# Altium schematic sheet HeatMapNodeV1.SchDoc: HeatMap Node
size Letter; Date: 1/5/2017 3:00:38 PM; Author: Team HeatMap; DocumentNumber: 01; Revision: 01; SheetNumber: 1; SheetTotal: 1; REV: 1
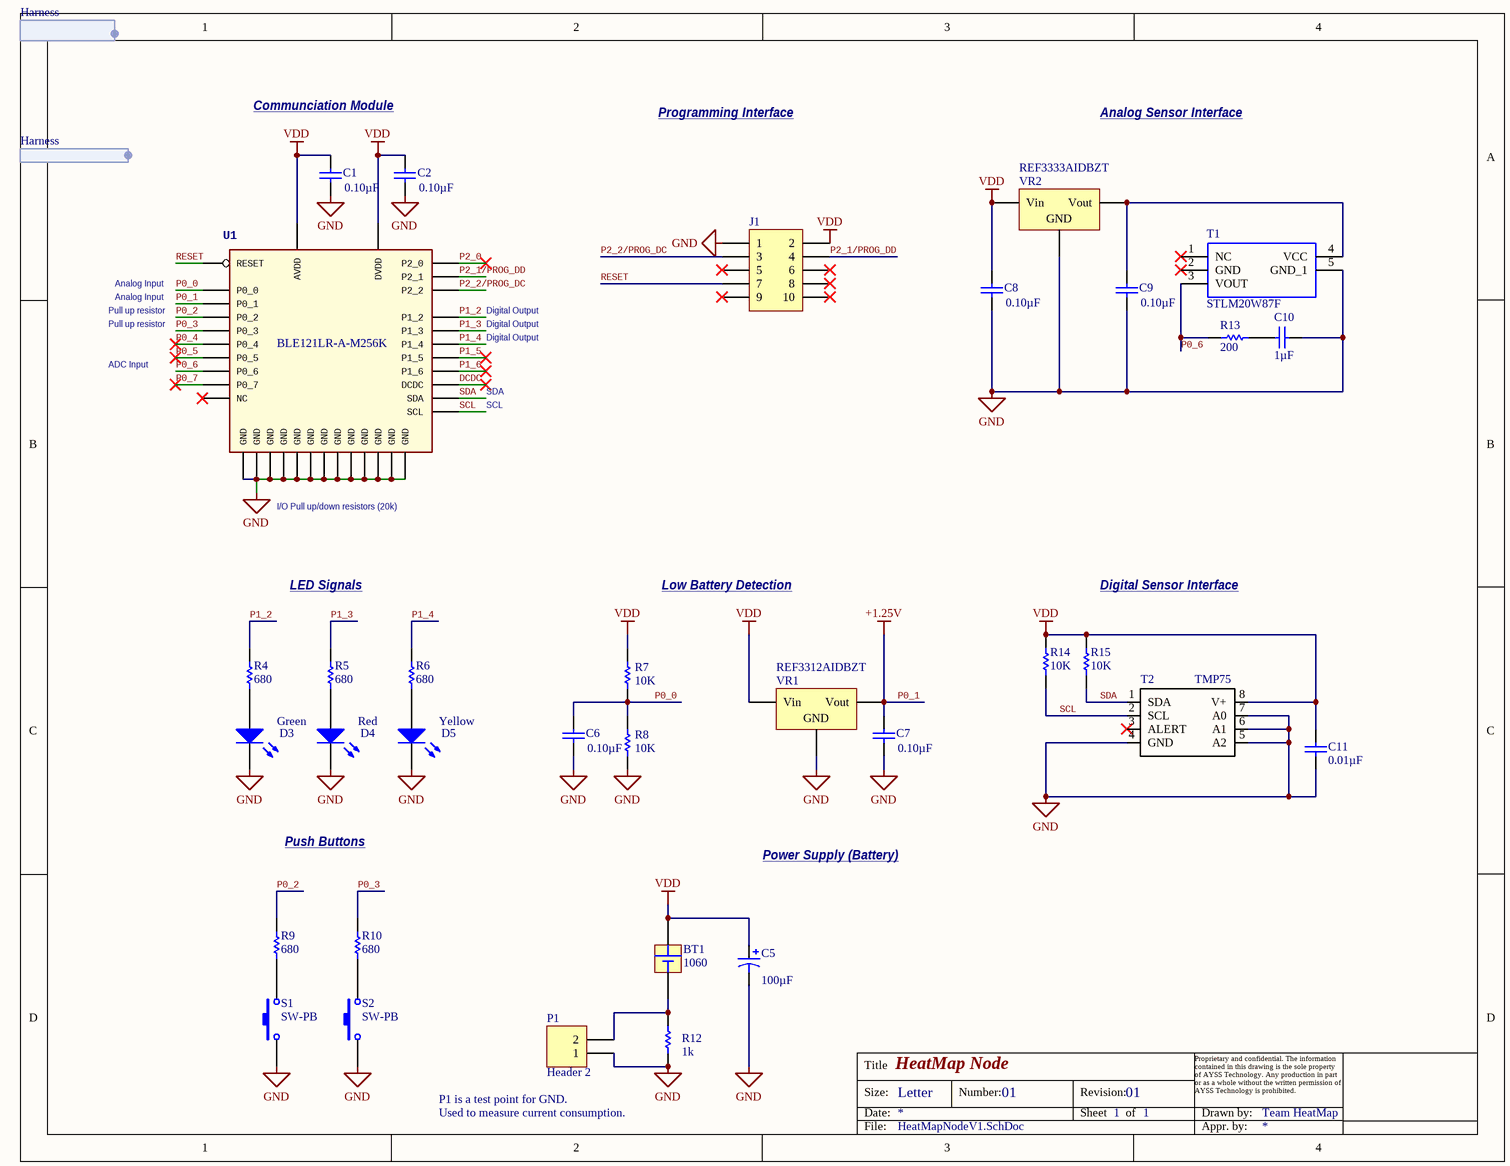
[diagram p0: HeatMapNodeV1.SchDoc]

## Parts
BT1  1060  [1060]
C1  value 0.10µF  [6-0805_M]  (hidden comment: Cap Semi)
C2  value 0.10µF  [6-0805_M]  (hidden comment: Cap Semi)
C5  value 100µF  [D]  (hidden comment: Cap Pol3)
C6  value 0.10µF  [6-0805_M]  (hidden comment: Cap Semi)
C7  value 0.10µF  [6-0805_M]  (hidden comment: Cap Semi)
C8  value 0.10µF  [6-0805_M]  (hidden comment: Cap Semi)
C9  value 0.10µF  [6-0805_M]  (hidden comment: Cap Semi)
C10  value 1µF  [6-0805_M]  (hidden comment: Cap Semi)
C11  value 0.01µF  [6-0805_M]  (hidden comment: Cap Semi)
D3  Color: Green  [2.0X1.25X1.2]  (hidden comment: LED2)
D4  Color: Red  [2.0X1.25X1.2]  (hidden comment: LED2)
D5  Color: Yellow  [2.0X1.25X1.2]  (hidden comment: LED2)
J1  Header 5X2  [HDR2X5_SMD_127]  (value not drawn)
P1  Header 2  [HDR1X2]
R4  value 680  [6-0805_M]  (hidden comment: Res1)
R5  value 680  [6-0805_M]  (hidden comment: Res1)
R6  value 680  [6-0805_M]  (hidden comment: Res1)
R7  value 10K  [6-0805_M]  (hidden comment: Res1)
R8  value 10K  [6-0805_M]  (hidden comment: Res1)
R9  value 680  [6-0805_M]  (hidden comment: Res1)
R10  value 680  [6-0805_M]  (hidden comment: Res1)
R12  value 1k  [6-0805_M]  (hidden comment: Res1)
R13  value 200  [6-0805_M]  (hidden comment: Res1)
R14  value 10K  [6-0805_M]  (hidden comment: Res1)
R15  value 10K  [6-0805_M]  (hidden comment: Res1)
S1  SW-PB  [SA]
S2  SW-PB  [SA]
T1  STLM20W87F  [SOT65P210X110-5N]
T2  TMP75  [MSOP8]
U1  Manufacturer Part Number: BLE121LR-A-M256K  [BLE121LR]  (hidden comment: BLE121LR module)
VR1  Manufacturer Part Number: REF3312AIDBZT  [SOT23_M]  (hidden comment: Volt Reg)
VR2  Manufacturer Part Number: REF3333AIDBZT  [SOT23_M]  (hidden comment: Volt Reg)

## Harnesses
Harness: 

## Nets
GND: C1.1 C2.1 C5.2 C6.1 C7.1 C8.1 C9.1 C10.1 C11.1 D3.2(K) D4.2(K) D5.2(K) J1.1 P1.1 R8.1 R12.2 S1.1 S2.1 T1.5(GND_1) T2.4(GND) T2.5(A2) T2.6(A1) T2.7(A0) U1.1(GND) U1.2(GND) U1.3(GND) U1.14(GND) U1.15(GND) U1.16(GND) U1.22(GND) U1.31(GND) U1.32(GND) U1.33(GND) U1.34(GND) U1.35(GND) U1.36(GND) VR1.2(GND) VR2.2(GND)
P0_1: C7.2 U1.5(P0_1) VR1.3(Vout)  [also labelled +1.25V]
VDD: BT1.2(+) C1.2 C2.2 C5.1 C8.2 C11.2 J1.2 R7.2 R14.1 R15.1 T2.8(V+) U1.13(AVDD) U1.23(DVDD) VR1.1(Vin) VR2.1(Vin)
DCDC: U1.18(DCDC)
P0_0: C6.2 R7.1 R8.2 U1.6(P0_0)
P0_2: R9.1 U1.4(P0_2)
P0_3: R10.1 U1.8(P0_3)
P0_4: U1.9(P0_4)
P0_5: U1.10(P0_5)
P0_6: R13.1 T1.3(VOUT) U1.11(P0_6)
P0_7: U1.12(P0_7)
P1_2: R4.1 U1.30(P1_2)
P1_3: R5.1 U1.29(P1_3)
P1_4: R6.1 U1.28(P1_4)
P1_5: U1.27(P1_5)
P1_6: U1.17(P1_6)
P2_0: U1.19(P2_0)
P2_1/PROG_DD: J1.4 U1.20(P2_1)
P2_2/PROG_DC: J1.3 U1.21(P2_2)
RESET: J1.7 U1.7(RESET)
SCL: R14.2 T2.2(SCL) U1.24(SCL)
SDA: R15.2 T2.1(SDA) U1.25(SDA)
NetBT1_1: BT1.1(-) P1.2 R12.1
NetC9_2: C9.2 T1.4(VCC) VR2.3(Vout)
NetC10_2: C10.2 R13.2
NetD3_1: D3.1(A) R4.2
NetD4_1: D4.1(A) R5.2
NetD5_1: D5.1(A) R6.2
NetR9_2: R9.2 S1.2
NetR10_2: R10.2 S2.2

Not connected (* = marked no-connect by the designer): J1 5* 6* 8* 9* 10*; T1 1(NC)* 2(GND)*; T2 3(ALERT)*; U1 26(NC)*

## Notes on the sheet
- Communciation Module
- Programming Interface
- Analog Sensor Interface
- Analog Input
- (near U1) Pull up resistor
- ADC Input
- Digital Output
- SDA
- SCL
- (near U1) I/O Pull up/down resistors (20k)
- LED Signals
- Low Battery Detection
- Digital Sensor Interface
- Push Buttons
- Power Supply (Battery)
- (near P1) P1 is a test point for GND.
- Used to measure current consumption.
- Title
- Size:
- Date:
- Letter
- Number:
- Revision:
- Sheet
- of
- Proprietary and confidential. The information contained in this drawing is the sole property of AYSS Technology. Any production in part or as a whole without the written permission of AYSS Technology is prohibited.
- Drawn by:
- File:
- Appr. by:

## Library data of the parts
BT1 = Battery: Coin Cell Battery 2032 Holder; Manufacturer: Keystone Electronics; Battery Type, Function: Coin Cell, Holder; Style: Holder (Open); Battery Cell Size: Coin, 20.0mm; Number of Cells: 1; Battery Series: 2032; Supplier 1: Digi-Key; Supplier Part Number 1: 36-1060-ND; Manufacturer Part Number: 1060; RoHS: RoHS Compliant; Category: Battery Products; Stock 1: 5034; Pricing 1: 1=1.79, 10=1.475, 50=1.3244, 100=1.2642, 250=1.1438, 500=1.0535, 1000=1.01202, 2500=0.903, 5000=0.80066 (USD); Part Status: Active; Mounting Type: PCB, Surface Mount; Termination Style: SMD (SMT) Tab; Height Above Board: 0.217" (5.50mm); Operating Temperature: -50°C ~ 145°C; ComponentLink1URL: http://www.keyelco.com/product-pdf.cfm?p=726; ComponentLink1Description: http://www.keyelco.com/product-pdf.cfm?p=726
C1 C2 C6-C9 = Cap Semi: Capacitor (Semiconductor SIM Model); Manufacturer: Taiyo Yuden; Manufacturer Part Number: HMK212B7104KG-T; Tolerance: ±10%; Voltage - Rated: 100V; Temperature Coefficient: X7R; Published: 8-Jun-2000; LatestRevisionDate: 29-May-2009; LatestRevisionNote: IPC-7351 Footprint Added.; Publisher: Altium Limited; PackageDescription: Chip Capacitor; Supplier 1: Digi-Key; Supplier Part Number 1: 587-1276-1-ND; RoHS: RoHS Compliant; Category: Capacitors; Stock 1: 4553; Pricing 1: 1=0.19, 10=0.128, 25=0.0936, 50=0.0766, 100=0.0647, 250=0.05276, 500=0.04426, 1000=0.03915 (USD); Packaging: Cut Tape (CT); Part Status: Active; Capacitance: 0.10µF; Operating Temperature: -55°C ~ 125°C; Features: High Voltage; Ratings: -; Applications: General Purpose; Mounting Type: Surface Mount, MLCC; Package / Case: 0805 (2012 Metric); Size / Dimension: 0.079" L x 0.049" W (2.00mm x 1.25mm); Height - Seated (Max): -; Thickness (Max): 0.053" (1.35mm); Lead Spacing: -; Lead Style: -; ComponentLink1URL: http://ds.yuden.co.jp/TYCOMPAS/ut/detail.do?productNo=HMK212B7104KG-T&fileName=HMK212B7104KG-T_SS&mode=specSheetDownload; ComponentLink1Description: http://ds.yuden.co.jp/TYCOMPAS/ut/detail.do?productNo=HMK212B7104KG-T&fileName=HMK212B7104KG-T_SS&mode=specSheetDownload
C5 = Cap Pol3: Polarized Capacitor (Surface Mount); Manufacturer: KEMET; Manufacturer Part Number: T495D107K016ATE125; Tolerance: ±10%; Voltage - Rated: 16V; Type: Molded; ESR (Equivalent Series Resistance): 125 mOhm; Lifetime @ Temp.: 2000 Hrs @ 85°C; Published: 8-Jun-2000; LatestRevisionDate: 29-May-2009; LatestRevisionNote: IPC-7351 Footprint Added.; PackageReference: C0805; Publisher: Altium Limited; PackageDescription: Chip Capacitor; Supplier 1: Digi-Key; Supplier Part Number 1: 399-8499-1-ND; RoHS: RoHS Compliant; Category: Capacitors; Stock 1: 19470; Pricing 1: 1=1.37, 10=1.084, 25=0.9936, 50=0.9394, 100=0.8129, 250=0.72264 (USD); Packaging: Cut Tape (CT); Part Status: Active; Capacitance: 100µF; Operating Temperature: -55°C ~ 125°C; Mounting Type: Surface Mount; Package / Case: 2917 (7343 Metric); Size / Dimension: 0.287" L x 0.169" W (7.30mm x 4.30mm); Height - Seated (Max): 0.122" (3.10mm); Lead Spacing: -; Manufacturer Size Code: D; Features: General Purpose; Failure Rate: -; ComponentLink1URL: http://www.kemet.com/docfinder?Partnumber=T495D107K016ATE125; ComponentLink1Description: http://www.kemet.com/docfinder?Partnumber=T495D107K016ATE125
C10 C11 = Cap Semi: Capacitor (Semiconductor SIM Model); Manufacturer: Taiyo Yuden; Manufacturer Part Number: HMK212B7104KG-T; Capacitance: 0.10µF; Tolerance: ±10%; Voltage - Rated: 100V; Temperature Coefficient: X7R; Published: 8-Jun-2000; LatestRevisionDate: 29-May-2009; LatestRevisionNote: IPC-7351 Footprint Added.; Publisher: Altium Limited; PackageDescription: Chip Capacitor; Supplier 1: Digi-Key; Supplier Part Number 1: 587-1276-1-ND; RoHS: RoHS Compliant; Category: Capacitors; Stock 1: 4553; Pricing 1: 1=0.19, 10=0.128, 25=0.0936, 50=0.0766, 100=0.0647, 250=0.05276, 500=0.04426, 1000=0.03915 (USD); Packaging: Cut Tape (CT); Part Status: Active; Operating Temperature: -55°C ~ 125°C; Features: High Voltage; Ratings: -; Applications: General Purpose; Mounting Type: Surface Mount, MLCC; Package / Case: 0805 (2012 Metric); Size / Dimension: 0.079" L x 0.049" W (2.00mm x 1.25mm); Height - Seated (Max): -; Thickness (Max): 0.053" (1.35mm); Lead Spacing: -; Lead Style: -; ComponentLink1URL: http://ds.yuden.co.jp/TYCOMPAS/ut/detail.do?productNo=HMK212B7104KG-T&fileName=HMK212B7104KG-T_SS&mode=specSheetDownload; ComponentLink1Description: http://ds.yuden.co.jp/TYCOMPAS/ut/detail.do?productNo=HMK212B7104KG-T&fileName=HMK212B7104KG-T_SS&mode=specSheetDownload
D3 = LED2: Typical RED, GREEN, YELLOW, AMBER GaAs LED; Manufacturer: Visual Communications Company - VCC; Manufacturer Part Number: CMD17-21VGD/TR8; Lens Transparency: Diffused; Millicandela Rating: 7mcd; Lens Style/Size: Rectangle with Flat Top, 1.40mm x 1.25mm; Voltage - Forward (Vf) (Typ): 2.1V; Current - Test: 20mA; Viewing Angle: 140°; Wavelength - Peak: 570nm; Supplier 1: Digi-Key; Supplier Part Number 1: L62505CT-ND; RoHS: RoHS Compliant; Category: Optoelectronics; Stock 1: 21325; Pricing 1: 1=0.5, 10=0.364, 25=0.2972, 100=0.2376, 250=0.20048, 500=0.17078, 1000=0.13365 (USD); Packaging: Cut Tape (CT); Part Status: Active; Lens Color: Green; Mounting Type: Surface Mount; Wavelength - Dominant: -; Features: -; Package / Case: 0805 (2012 Metric); Supplier Device Package: 0805; Size / Dimension: 2.00mm L x 1.25mm W; Height (Max): 1.20mm; ComponentLink1URL: http://vcclite.com/_pdf/CMD17-21%20Series%20SMT%20LEDs%200805%20Package%20Size.pdf; ComponentLink1Description: http://vcclite.com/_pdf/CMD17-21%20Series%20SMT%20LEDs%200805%20Package%20Size.pdf
D4 = LED2: Typical RED, GREEN, YELLOW, AMBER GaAs LED; Manufacturer: Visual Communications Company - VCC; Manufacturer Part Number: CMD17-21VRD/TR8; Lens Transparency: Diffused; Millicandela Rating: 6mcd; Lens Style/Size: Rectangle with Flat Top, 1.40mm x 1.25mm; Voltage - Forward (Vf) (Typ): 2V; Current - Test: 20mA; Viewing Angle: 140°; Wavelength - Peak: 640nm; Supplier 1: Digi-Key; Supplier Part Number 1: L62501CT-ND; RoHS: RoHS Compliant; Category: Optoelectronics; Stock 1: 24797; Pricing 1: 1=0.54, 10=0.388, 25=0.3168, 100=0.2534, 250=0.21384, 500=0.18216, 1000=0.14256 (USD); Packaging: Cut Tape (CT); Part Status: Active; Lens Color: Red; Mounting Type: Surface Mount; Wavelength - Dominant: -; Features: -; Package / Case: 0805 (2012 Metric); Supplier Device Package: 0805; Size / Dimension: 2.00mm L x 1.25mm W; Height (Max): 1.20mm; ComponentLink1URL: http://vcclite.com/_pdf/CMD17-21%20Series%20SMT%20LEDs%200805%20Package%20Size.pdf; ComponentLink1Description: http://vcclite.com/_pdf/CMD17-21%20Series%20SMT%20LEDs%200805%20Package%20Size.pdf
D5 = LED2: Typical RED, GREEN, YELLOW, AMBER GaAs LED; Manufacturer: Visual Communications Company - VCC; Manufacturer Part Number: CMD17-21VYD/TR8; Lens Transparency: Diffused; Millicandela Rating: 4mcd; Lens Style/Size: Rectangle with Flat Top, 1.40mm x 1.25mm; Voltage - Forward (Vf) (Typ): 2V; Current - Test: 20mA; Viewing Angle: 140°; Wavelength - Peak: 585nm; Supplier 1: Digi-Key; Supplier Part Number 1: L62507CT-ND; RoHS: RoHS Compliant; Category: Optoelectronics; Stock 1: 10342; Pricing 1: 1=0.61, 10=0.437, 25=0.3564, 100=0.2851, 250=0.24056, 500=0.20494, 1000=0.16038 (USD); Packaging: Cut Tape (CT); Part Status: Active; Lens Color: Yellow; Mounting Type: Surface Mount; Wavelength - Dominant: -; Features: -; Package / Case: 0805 (2012 Metric); Supplier Device Package: 0805; Size / Dimension: 2.00mm L x 1.25mm W; Height (Max): 1.20mm; ComponentLink1URL: http://vcclite.com/_pdf/CMD17-21%20Series%20SMT%20LEDs%200805%20Package%20Size.pdf; ComponentLink1Description: http://vcclite.com/_pdf/CMD17-21%20Series%20SMT%20LEDs%200805%20Package%20Size.pdf
J1 = Header 5X2: Header, 5-Pin, Dual row; Manufacturer: Amphenol FCI; Manufacturer Part Number: 20021521-00010T1LF; Connector Type: Header, Shrouded; Pitch: 0.050" (1.27mm); Number of Positions: 10; Number of Positions Loaded: All; LatestRevisionDate: 17-Jul-2002; LatestRevisionNote: Re-released for DXP Platform.; Publisher: Altium Limited; Supplier 1: Digi-Key; Supplier Part Number 1: 609-4054-ND; RoHS: RoHS Compliant; Category: Connectors, Interconnects; Stock 1: 34633; Pricing 1: 1=1.11, 10=0.973, 100=0.8393, 500=0.6867, 1000=0.6104, 5000=0.5341, 10000=0.5074 (USD); Packaging: Tube; Part Status: Active; Contact Type: Male Pin; Number of Rows: 2; Row Spacing: 0.050" (1.27mm); Mounting Type: Surface Mount; Termination: Solder; Fastening Type: -; Contact Mating Length: -; Features: -; Contact Finish: Gold; Contact Finish Thickness: Flash; Color: Black; ComponentLink1URL: http://portal.fciconnect.com/Comergent//fci/drawing/20021521.pdf; ComponentLink1Description: http://portal.fciconnect.com/Comergent//fci/drawing/20021521.pdf
P1 = Header 2: Header, 2-Pin
R4-R6 R9 R10 = Res1: Resistor; Manufacturer: Vishay Dale; Manufacturer Part Number: CRCW0805680RFKEA; Tolerance: ±1%; Power (Watts): 0.125W, 1/8W; Temperature Coefficient: ±100ppm/°C; Supplier 1: Digi-Key; Supplier Part Number 1: 541-680CCT-ND; RoHS: RoHS Compliant; Category: Resistors; Stock 1: 37773; Pricing 1: 1=0.1, 10=0.04, 25=0.0288, 50=0.022, 100=0.0162, 250=0.01236, 500=0.0099, 1000=0.00729 (USD); Packaging: Cut Tape (CT); Part Status: Active; Resistance (Ohms): 680; Composition: Thick Film; Features: Automotive AEC-Q200; Operating Temperature: -55°C ~ 155°C; Package / Case: 0805 (2012 Metric); Supplier Device Package: 0805; Size / Dimension: 0.079" L x 0.049" W (2.00mm x 1.25mm); Height - Seated (Max): 0.020" (0.50mm); Number of Terminations: 2; Failure Rate: -; ComponentLink1URL: http://www.vishay.com/docs/20035/dcrcwe3.pdf; ComponentLink1Description: http://www.vishay.com/docs/20035/dcrcwe3.pdf
R7 R8 = Res1: Resistor; Manufacturer: Vishay Dale; Manufacturer Part Number: CRCW080510K0FKEA; Tolerance: ±1%; Power (Watts): 0.125W, 1/8W; Temperature Coefficient: ±100ppm/°C; Supplier 1: Digi-Key; Supplier Part Number 1: 541-10.0KCCT-ND; RoHS: RoHS Compliant; Category: Resistors; Stock 1: 531677; Pricing 1: 1=0.1, 10=0.04, 25=0.0288, 50=0.022, 100=0.0162, 250=0.01236, 500=0.0099, 1000=0.00729 (USD); Packaging: Cut Tape (CT); Part Status: Active; Resistance (Ohms): 10k; Composition: Thick Film; Features: Automotive AEC-Q200; Operating Temperature: -55°C ~ 155°C; Package / Case: 0805 (2012 Metric); Supplier Device Package: 0805; Size / Dimension: 0.079" L x 0.049" W (2.00mm x 1.25mm); Height - Seated (Max): 0.020" (0.50mm); Number of Terminations: 2; Failure Rate: -; ComponentLink1URL: http://www.vishay.com/docs/20035/dcrcwe3.pdf; ComponentLink1Description: http://www.vishay.com/docs/20035/dcrcwe3.pdf
R12 = Res1: Resistor; Manufacturer: Vishay Dale; Manufacturer Part Number: CRCW08050000Z0EA; Resistance (Ohms): 0.0; Tolerance: Jumper; Power (Watts): 0.125W, 1/8W; Supplier 1: Digi-Key; Supplier Part Number 1: 541-0.0ACT-ND; RoHS: RoHS Compliant; Category: Resistors; Stock 1: 1246099; Pricing 1: 1=0.1, 10=0.026, 25=0.0184, 50=0.014, 100=0.0104, 250=0.00792, 500=0.00634, 1000=0.00466 (USD); Packaging: Cut Tape (CT); Part Status: Active; Composition: Thick Film; Features: Automotive AEC-Q200; Temperature Coefficient: -; Operating Temperature: -55°C ~ 155°C; Package / Case: 0805 (2012 Metric); Supplier Device Package: 0805; Size / Dimension: 0.079" L x 0.049" W (2.00mm x 1.25mm); Height - Seated (Max): 0.020" (0.50mm); Failure Rate: -; ComponentLink1URL: http://www.vishay.com/docs/20035/dcrcwe3.pdf; ComponentLink1Description: http://www.vishay.com/docs/20035/dcrcwe3.pdf
R13-R15 = Res1: Resistor; Manufacturer: Vishay Dale; Manufacturer Part Number: CRCW0805680RFKEA; Resistance (Ohms): 680; Tolerance: ±1%; Power (Watts): 0.125W, 1/8W; Temperature Coefficient: ±100ppm/°C; Supplier 1: Digi-Key; Supplier Part Number 1: 541-680CCT-ND; RoHS: RoHS Compliant; Category: Resistors; Stock 1: 37773; Pricing 1: 1=0.1, 10=0.04, 25=0.0288, 50=0.022, 100=0.0162, 250=0.01236, 500=0.0099, 1000=0.00729 (USD); Packaging: Cut Tape (CT); Part Status: Active; Composition: Thick Film; Features: Automotive AEC-Q200; Operating Temperature: -55°C ~ 155°C; Package / Case: 0805 (2012 Metric); Supplier Device Package: 0805; Size / Dimension: 0.079" L x 0.049" W (2.00mm x 1.25mm); Height - Seated (Max): 0.020" (0.50mm); Number of Terminations: 2; Failure Rate: -; ComponentLink1URL: http://www.vishay.com/docs/20035/dcrcwe3.pdf; ComponentLink1Description: http://www.vishay.com/docs/20035/dcrcwe3.pdf
S1 S2 = SW-PB: Switch; Manufacturer: C&K; Manufacturer Part Number: EP11FPD1SAPE(T&R); Circuit: SPST-NO; Switch Function: Off-Mom; Current Rating: 0.4VA (AC/DC); Voltage Rating - AC: 20V; Actuator Type: Round, Plunger, Flush; Color - Actuator/Cap: White; Ingress Protection: IP57 - Dust Protected, Waterproof; Electrical Life: 60,000 Cycles; Supplier 1: Digi-Key; Supplier Part Number 1: CKN9051CT-ND; RoHS: RoHS Compliant; Category: Switches; Stock 1: 2128; Pricing 1: 1=5, 10=4.759, 25=4.5208, 50=4.4018, 100=4.2827, 250=4.0448 (USD); Packaging: Cut Tape (CT); Part Status: Active; Type: Standard; Voltage Rating - DC: 20V; Illumination Type, Color: -; Illumination Voltage (Nominal): -; Mounting Type: Surface Mount, Right Angle; Termination Style: Gull Wing; Features: Epoxy Sealed Terminals; Panel Cutout Dimensions: -; Operating Temperature: -30°C ~ 85°C; Mechanical Life: -; ComponentLink1URL: http://www.ckswitches.com/media/1408/ep.pdf; ComponentLink1Description: http://www.ckswitches.com/media/1408/ep.pdf
T1 = STLM20W87F: STLM20W87F, Temperature Sensor 1.5C 2.4 to 5.5V 5-Pin SOT-323; Manufacturer_Name: STMicroelectronics; Allied_Number: 70390883; Geometry.Height: 1.1mm; Manufacturer_Part_Number: STLM20W87F; RS Part Number: 1685835; RS Price/Stock: http://uk.rs-online.com/web/p/products/1685835; Allied Price/Stock: http://www.alliedelec.com/stmicroelectronics-stlm20w87f/70390883/; Arrow Part Number: STLM20W87F; Arrow Price/Stock: https://www.arrow.com/en/products/stlm20w87f/stmicroelectronics; Datasheet Link: http://www.st.com/st-web-ui/static/active/en/resource/technical/document/datasheet/CD00119601.pdf
T2 = TMP75: the tmp175 and tmp75 are two-wire serial output temperature sensors available in so-8 and msop-8 packages. requiring ...; MF: Texas Instruments; SnapEDA_Link: https://www.snapeda.com/parts/TMP75/Texas%2520Instruments/view-part/?ref=snap; Availability: Unavailable; Price: None; Package: None; MP: TMP75; Value: *
U1 = BLE121LR: Bluetooth Low Energy (BLE) module; Manufacturer: Silicon Labs; Protocol: Bluetooth v4.0; Frequency: 2.4GHz; Data Rate: 2Mbps; Power - Output: 8dBm; Sensitivity: -98dBm; Serial Interfaces: I²C, SPI, UART; Antenna Type: Integrated, Chip; Memory Size: 256kB Flash,  8kB SRAM; Voltage - Supply: 2 V ~ 3.6 V; Current - Receiving: 28mA ~ 33mA; Current - Transmitting: 25mA ~ 39mA; Supplier 1: Digi-Key; Supplier Part Number 1: 1446-1039-1-ND; RoHS: RoHS Compliant; Category: RF/IF and RFID; Stock 1: 4848; Pricing 1: 1=13.65, 10=12.346, 25=11.3712, 100=10.3965, 250=9.74672, 500=9.09692 (USD); Packaging: Cut Tape (CT); Part Status: Active; RF Family/Standard: Bluetooth; Modulation: -; Mounting Type: Surface Mount; Operating Temperature: -40°C ~ 85°C; Package / Case: Module; ComponentLink1URL: http://media.digikey.com/pdf/Data%20Sheets/BlueGiga%20PDFs/BLE121LR_V1.2.pdf; ComponentLink1Description: http://media.digikey.com/pdf/Data%20Sheets/BlueGiga%20PDFs/BLE121LR_V1.2.pdf
VR1 VR2 = Volt Reg: Voltage Regulator; pin to pad: 1>3 2>1 3>2; Manufacturer: Texas Instruments; Reference Type: Series; Output Type: Fixed; Voltage - Output (Min/Fixed): 1.25V; Current - Output: 5mA; Tolerance: ±0.15%; Temperature Coefficient: 30ppm/°C; Noise - 0.1Hz to 10Hz: 35µVp-p; Voltage - Input: 1.8 V ~ 5.5 V; Current - Supply: 8.5µA; Supplier 1: Digi-Key; Supplier Part Number 1: 296-22635-1-ND; RoHS: RoHS Compliant; Category: Integrated Circuits (ICs); Stock 1: 5482; Pricing 1: 1=2.14, 10=1.922, 100=1.5418 (USD); Packaging: Cut Tape (CT); Part Status: Active; Voltage - Output (Max): -; Noise - 10Hz to 10kHz: -; Current - Cathode: -; Operating Temperature: -40°C ~ 125°C (TA); Mounting Type: Surface Mount; Package / Case: TO-236-3, SC-59, SOT-23-3; Supplier Device Package: SOT-23-3; ComponentLink1URL: http://www.ti.com/lit/ds/symlink/ref3312.pdf; ComponentLink1Description: http://www.ti.com/lit/ds/symlink/ref3312.pdf